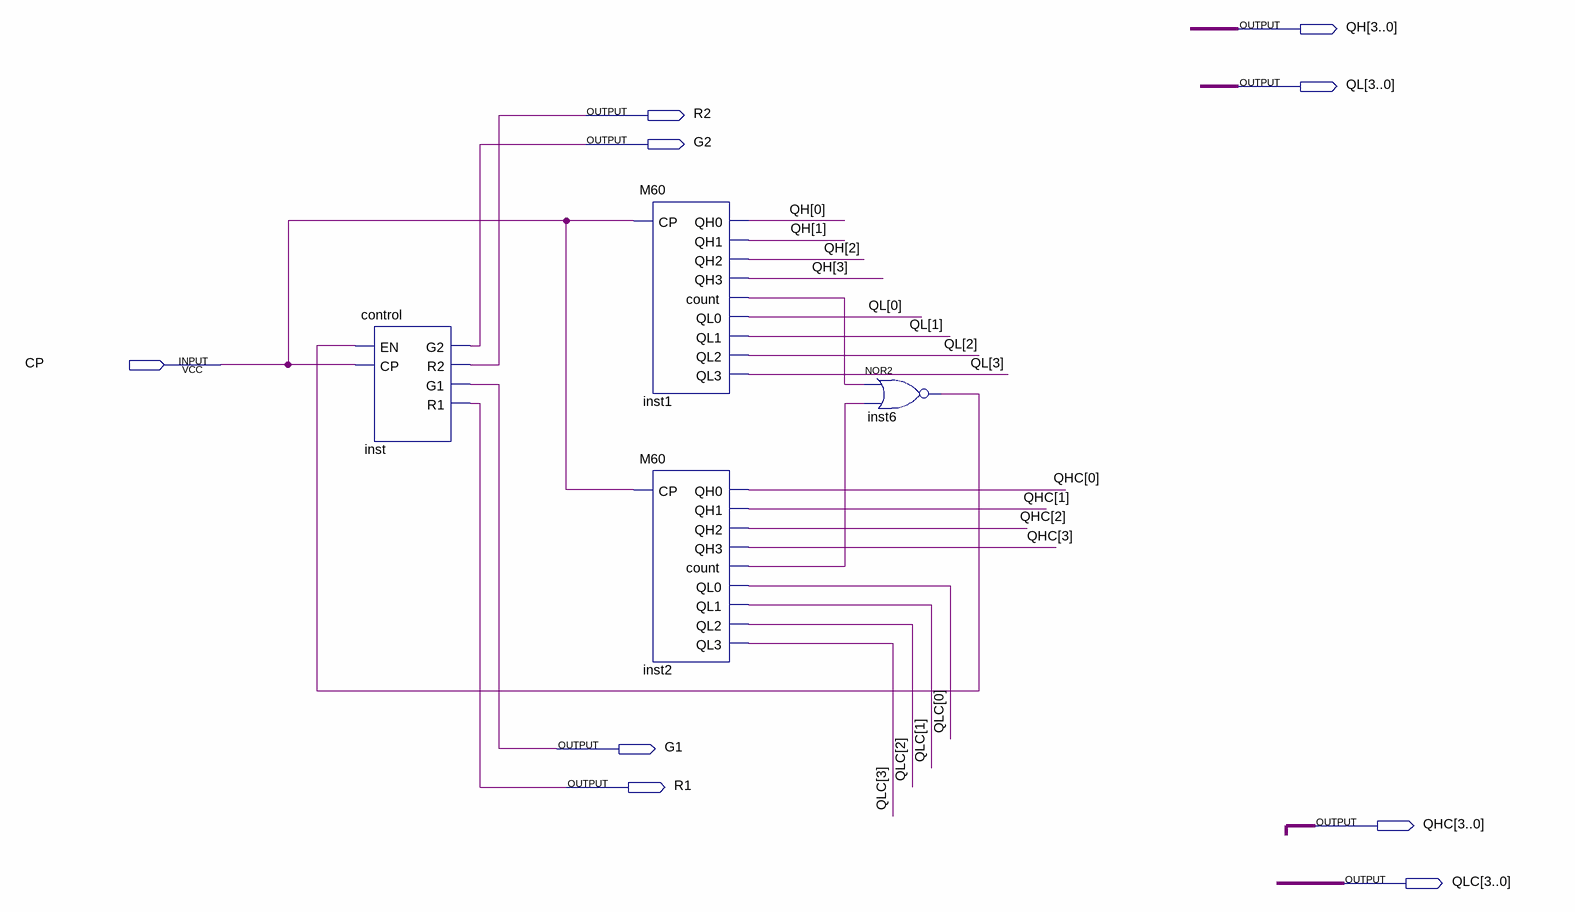
[diagram p0: schematic sheet]
// Quartus schematic LIGHT.bdf as structural Verilog: 4 symbols, 9 pins
module LIGHT (
  input  CP,
  output [3:0] QH,
  output [3:0] QL,
  output R2,
  output G2,
  output G1,
  output R1,
  output [3:0] QHC,
  output [3:0] QLC
);

  wire inst1_count, inst2_count, inst6_out;

  control inst (.EN(inst6_out), .CP(CP), .G2(G2), .R2(R2), .G1(G1), .R1(R1));
  M60 inst1 (
    .CP(CP), .QH0(QH[0]), .QH1(QH[1]), .QH2(QH[2]), .QH3(QH[3]), .count(inst1_count), .QL0(QL[0]),
    .QL1(QL[1]), .QL2(QL[2]), .QL3(QL[3]));
  M60 inst2 (
    .CP(CP), .QH0(QHC[0]), .QH1(QHC[1]), .QH2(QHC[2]), .QH3(QHC[3]), .count(inst2_count), .QL0(QLC[0]),
    .QL1(QLC[1]), .QL2(QLC[2]), .QL3(QLC[3]));
  nor inst6 (inst6_out, inst1_count, inst2_count);
endmodule
